# Altium project GpioPowerAddon.PrjPcb
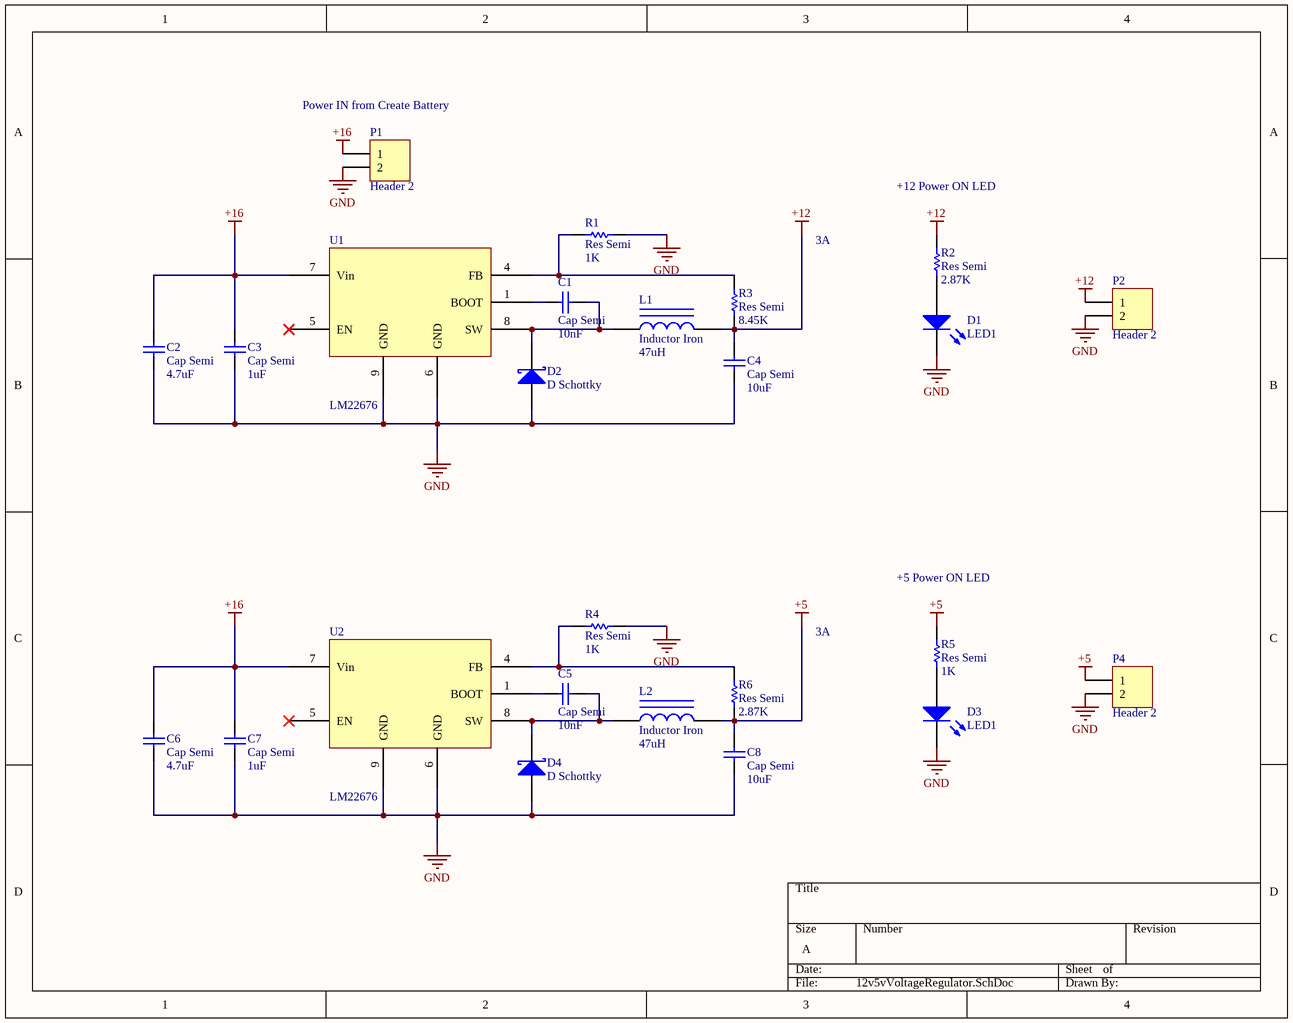
[diagram p0: 12v5vVoltageRegulator.SchDoc]
1 sheet, 25 parts. Net scope: global (net labels, ports and power ports of the same name join across sheets).
Board file: GpioPowerAddon.PcbDoc

## Sheet 12v5vVoltageRegulator.SchDoc
size A

### Parts
C1  Cap Semi  value 10nF  [CAPC2012L]
C2  Cap Semi  value 4.7uF  [CAPC4532L]
C3  Cap Semi  value 1uF  [CAPC2012L]
C4  Cap Semi  value 10uF  [CAPC3216L]
C5  Cap Semi  value 10nF  [CAPC2012L]
C6  Cap Semi  value 4.7uF  [CAPC4532L]
C7  Cap Semi  value 1uF  [CAPC2012L]
C8  Cap Semi  value 10uF  [CAPC3216L]
D1  LED1  [1206 - LED]
D2  D Schottky  [SMA]
D3  LED1  [1206 - LED]
D4  D Schottky  [SMA]
L1  Inductor Iron  value 47uH  [SRR1260]
L2  Inductor Iron  value 47uH  [SRR1260]
P1  Header 2  [Connector Molex 2]
P2  Header 2  [Connector Molex 2]
P4  Header 2  [Connector Molex 2]
R1  Res Semi  value 1K  [RESC2012N]
R2  Res Semi  value 2.87K  [RESC2012N]
R3  Res Semi  value 8.45K  [RESC2012N]
R4  Res Semi  value 1K  [RESC2012N]
R5  Res Semi  value 1K  [RESC2012N]
R6  Res Semi  value 2.87K  [RESC2012N]
U1  LM22676  [LM22676]
U2  LM22676  [LM22676]

### Nets
+5: C8.2 L2.2 P4.1 R5.2 R6.1
+12: C4.2 L1.2 P2.1 R2.2 R3.1
+16: C2.2 C3.2 C6.2 C7.2 P1.1 U1.7(Vin) U2.7(Vin)
GND: C2.1 C3.1 C4.1 C6.1 C7.1 C8.1 D1.K D2.A D3.K D4.A P1.2 P2.2 P4.2 R1.2 R4.2 U1.6(GND) U1.9(GND) U2.6(GND) U2.9(GND)
NetC1_1: C1.1 U1.1(BOOT)
NetC1_2: C1.2 D2.K L1.1 U1.8(SW)
NetC5_1: C5.1 U2.1(BOOT)
NetC5_2: C5.2 D4.K L2.1 U2.8(SW)
NetD1_A: D1.A R2.1
NetD3_A: D3.A R5.1
NetR1_1: R1.1 R3.2 U1.4(FB)
NetR4_1: R4.1 R6.2 U2.4(FB)

Not connected (* = marked no-connect by the designer): U1 5(EN)*; U2 5(EN)*

### Notes on the sheet
- (near P1) Power IN from Create Battery
- +12 Power ON LED
- 3A
- +5 Power ON LED

### Library data of the parts
C1-C8 = Cap Semi: Capacitor (Semiconductor SIM Model); Published: 8-Jun-2000; LatestRevisionDate: 29-May-2009; LatestRevisionNote: IPC-7351 Footprint Added.; PackageReference: C1206; Publisher: Altium Limited; PackageDescription: Chip Capacitor
D1 D3 = LED1: Typical RED GaAs LED; Published: 8-Jun-2000; LatestRevisionDate: 08-Jul-2005; LatestRevisionNote: Mech Layer 1 removed.; PackageReference: LED-1; Publisher: Altium Limited
D2 D4 = D Schottky: Schottky Diode; Published: 8-Jun-2000; LatestRevisionDate: 17-Jul-2002; LatestRevisionNote: Re-released for DXP Platform.; PackageReference: SMB; Publisher: Altium Limited; Code_JEDEC: DO-214-AA
L1 L2 = Inductor Iron: Magnetic-Core Inductor; Published: 24-Mar-1999; LatestRevisionDate: 17-Jul-2002; LatestRevisionNote: Re-released for DXP Platform.; PackageReference: AXIAL-0.9; Publisher: Altium Limited
P1 P2 P4 = Header 2: Header, 2-Pin; LatestRevisionDate: 17-Jul-2002; LatestRevisionNote: Re-released for DXP Platform.; Publisher: Altium Limited
R1-R6 = Res Semi: Semiconductor Resistor; Published: 8-Jun-2000; LatestRevisionDate: 17-Jul-2002; LatestRevisionNote: Re-released for DXP Platform.; PackageReference: AXIAL-0.5; Publisher: Altium Limited
U1 U2 = LM22676: 3A SIMPLE SWITCHER